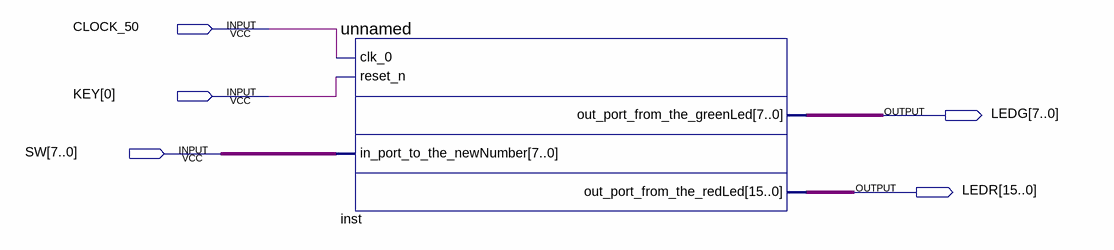
[diagram p0: schematic sheet]
// Quartus schematic lab2.bdf as structural Verilog: 1 symbols, 5 pins
module lab2 (
  input  CLOCK_50,
  input  [0:0] KEY,
  input  [7:0] SW,
  output [7:0] LEDG,
  output [15:0] LEDR
);

  unnamed inst (
    .clk_0(CLOCK_50), .reset_n(KEY[0]), .in_port_to_the_newNumber(SW), .out_port_from_the_greenLed(LEDG),
    .out_port_from_the_redLed(LEDR));
endmodule
